# Altium schematic sheet Sheet1.SchDoc
size A3
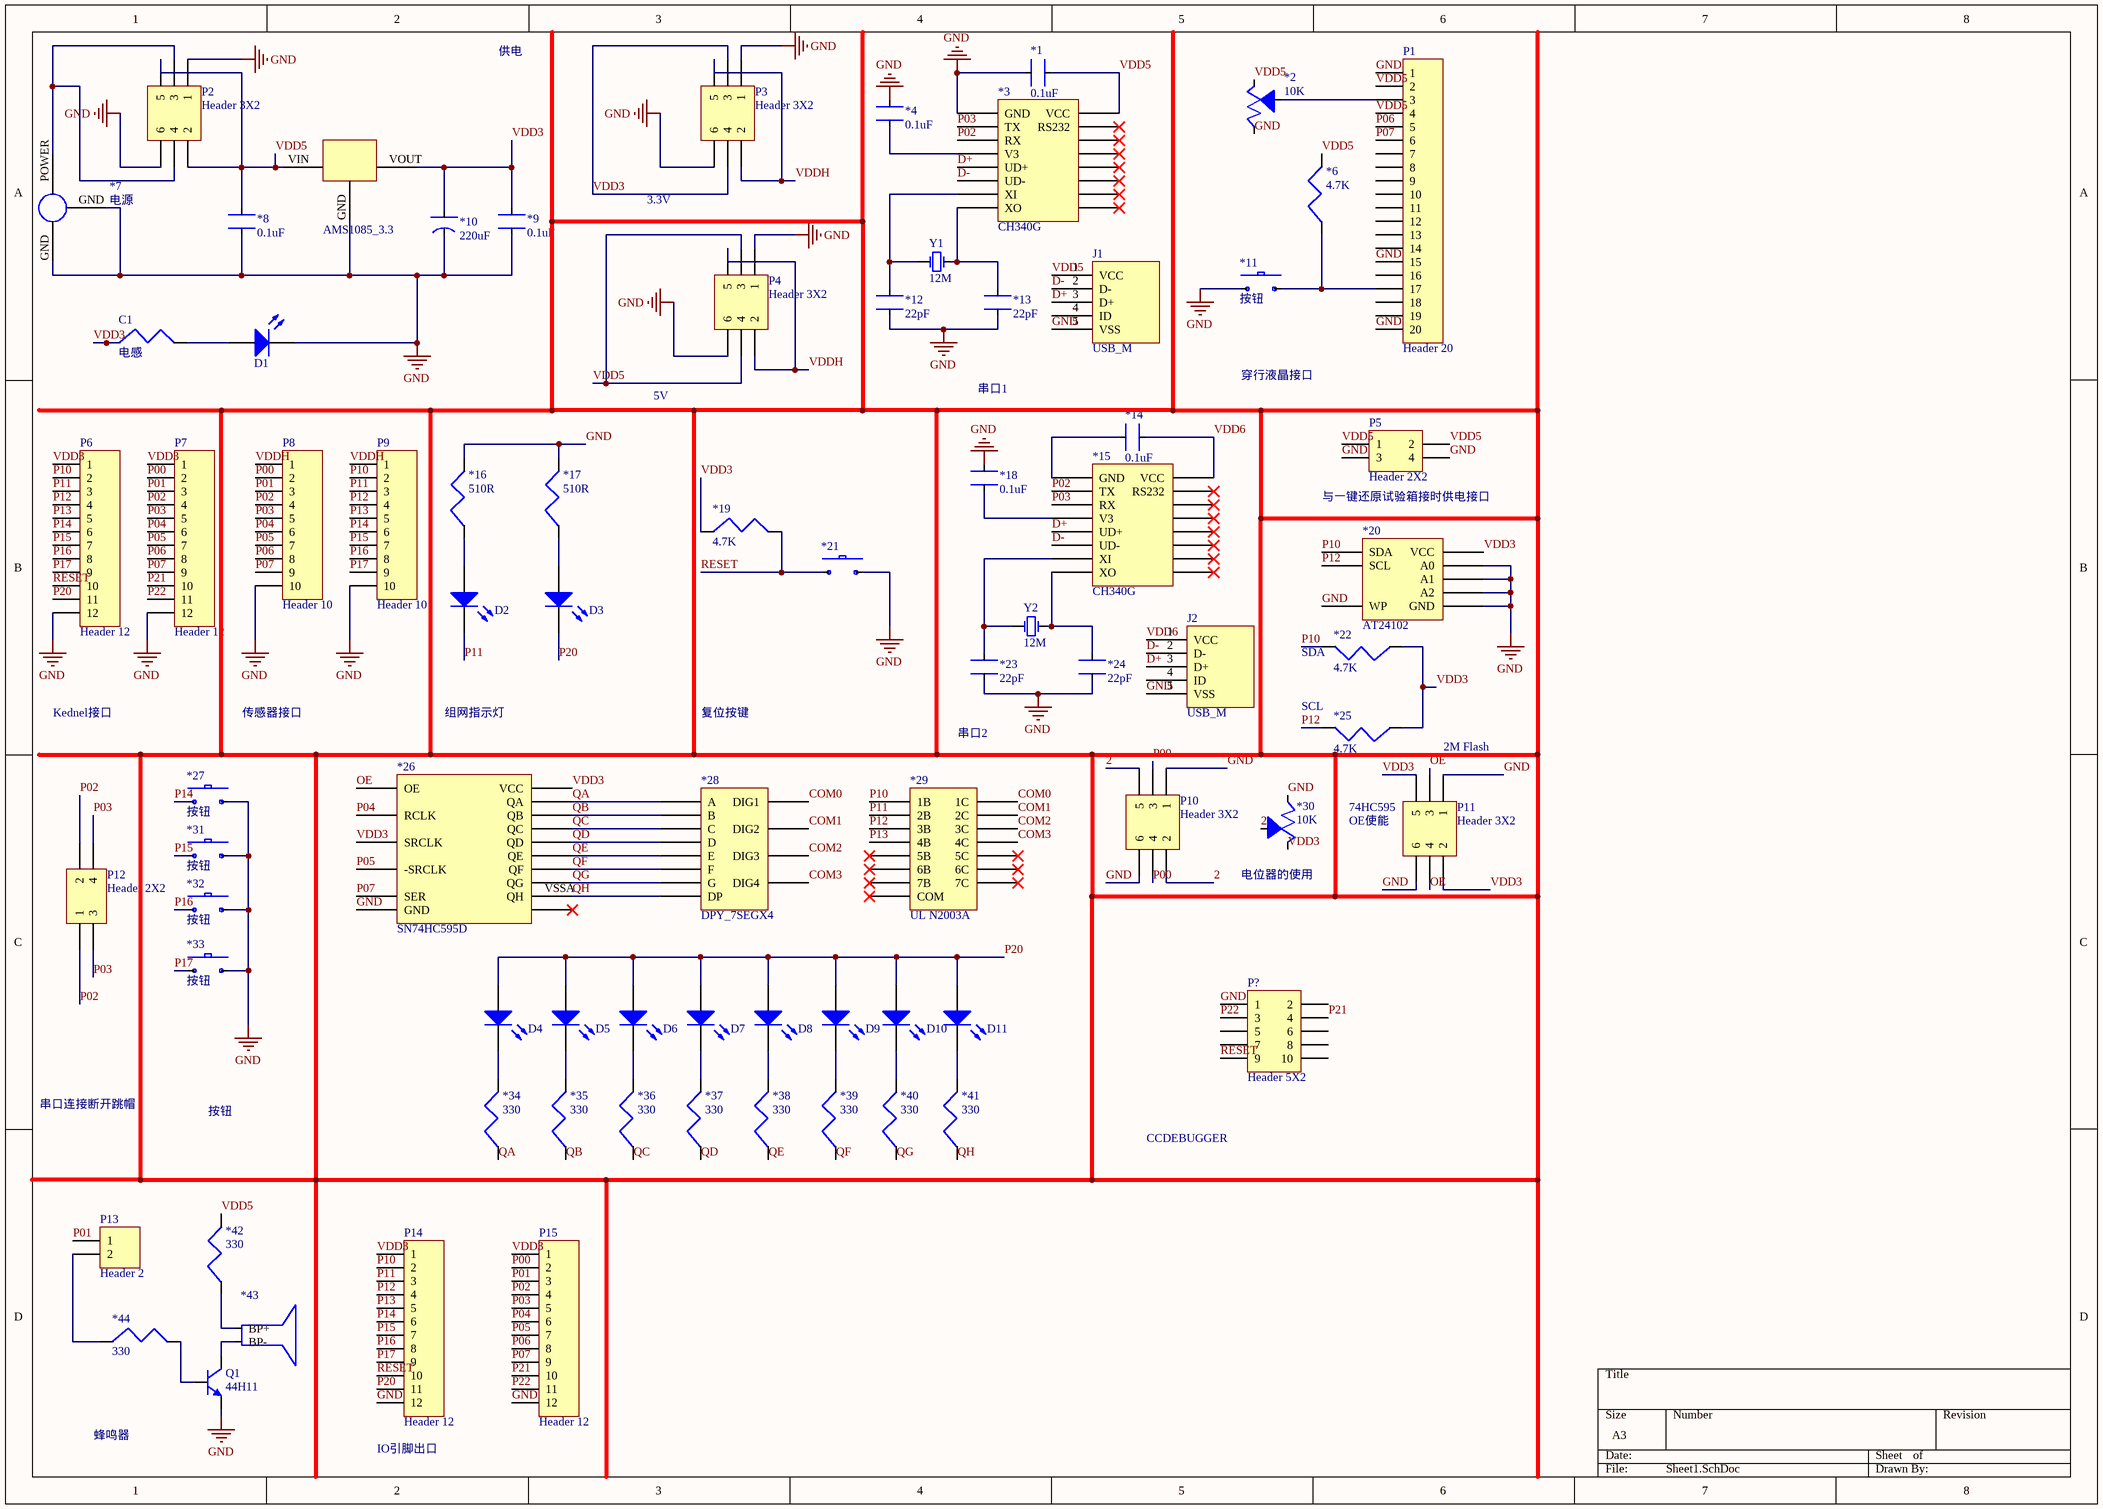
[diagram p0: Sheet1.SchDoc]

## Parts
*1  0.1uF  [C 0805_L]
*2  10K  [3303W]
*3  CH340G  [CH340G]
*4  0.1uF  [C 0805_L]
*5  AMS1085_3.3  [AMS1117-3.3V-SOT-223]
*6  4.7K  [L 0805]
*7  电源  [DC-005 - duplicate]
*8  0.1uF  [C 0805_L]
*9  0.1uF  [C 0805_L]
*10  220uF  [CAP 2.5*6.3*11.2 - BK]
*11  按钮  [按钮-6*6*4.3]
*12  22pF  [C 0805_L]
*13  22pF  [C 0805_L]
*14  0.1uF  [C 0805_L]
*15  CH340G  [CH340G]
*16  510R  [L 0805]
*17  510R  [L 0805]
*18  0.1uF  [C 0805_L]
*19  4.7K  [L 0805]
*20  AT24102  [AT24C02]
*21  按钮  [按钮-6*6*4.3]  (value not drawn)
*22  4.7K  [L 0805]
*23  22pF  [C 0805_L]
*24  22pF  [C 0805_L]
*25  4.7K  [L 0805]
*26  SN74HC595D  [74HC595D]
*27  按钮  [按钮-6*6*4.3]
*28  DPY_7SEGX4  [数码管_4P]
*29  UL N2003A  [ULN2003A]
*30  10K  [CLK_VOLUME]
*31  按钮  [按钮-6*6*4.3]
*32  按钮  [按钮-6*6*4.3]
*33  按钮  [按钮-6*6*4.3]
*34  330  [L 0805]
*35  330  [L 0805]
*36  330  [L 0805]
*37  330  [L 0805]
*38  330  [L 0805]
*39  330  [L 0805]
*40  330  [L 0805]
*41  330  [L 0805]
*42  330  [L 0805]
*43  蜂鸣器  [蜂鸣器侧装]
*44  330  [L 0805]
C1  电感  [L 0805]
D1  LED0  [LED_0805_Blue]  (value not drawn)
D2  LED0  [LED_0805_Blue]  (value not drawn)
D3  LED0  [LED_0805_Blue]  (value not drawn)
D4  LED0  [LED_0805_Blue]  (value not drawn)
D5  LED0  [LED_0805_Blue]  (value not drawn)
D6  LED0  [LED_0805_Blue]  (value not drawn)
D7  LED0  [LED_0805_Blue]  (value not drawn)
D8  LED0  [LED_0805_Blue]  (value not drawn)
D9  LED0  [LED_0805_Blue]  (value not drawn)
D10  LED0  [LED_0805_Blue]  (value not drawn)
D11  LED0  [LED_0805_Blue]  (value not drawn)
J1  USB_M  [USB]
J2  USB_M  [USB]
P1  Header 20  [HDR1X20]
P2  Header 3X2  [HDR2X3]
P3  Header 3X2  [HDR2X3]
P4  Header 3X2  [HDR2X3]
P5  Header 2X2  [HDR2X2]
P6  Header 12  [HDR1X12]
P7  Header 12  [HDR1X12]
P8  Header 10  [HDR1X10]
P9  Header 10  [HDR1X10]
P10  Header 3X2  [HDR2X3]
P11  Header 3X2  [HDR2X3]
P12  Header 2X2  [HDR2X2]
P13  Header 2  [HDR1X2]
P14  Header 12  [HDR1X12]
P15  Header 12  [HDR1X12]
P?  Header 5X2  [HDR2X5]
Q1  44H11  [三极管_To-92]
Y1  12M  [5032]
Y2  12M  [5032]

## Nets
GND: *1.VSSA *2.VSSA *3.VSSA(GND) *4.VSSA *5.GND(VSSA) *7.GND(VSSA) *8.VSSA *9.VSSA *10.VSSA *11.VSSA *12.VSSA *13.VSSA *16.VSSA *17.VSSA *18.VSSA *20.VSSA(WP) *21.VSSA *23.VSSA *24.VSSA *26.VSSA(GND) *27.VSSA *30.VSSA *31.VSSA *32.VSSA *33.VSSA D1.2(K) J1.5(VSS) J2.5(VSS) P1.1 P1.15 P1.20 P2.1 P2.6 P3.1 P3.6 P4.1 P4.6 P5.3 P5.4 P6.12 P7.12 P8.10 P9.10 P10.1 P10.6 P11.1 P11.6 P14.12 P15.12 P?.1 Q1.3(E)
2: *30.VSSA P10.2 P10.5
COM0: *28.VSSA(DIG1) *29.VSSA(1C)
COM1: *28.VSSA(DIG2) *29.VSSA(2C)
COM2: *28.VSSA(DIG3) *29.VSSA(3C)
COM3: *28.VSSA(DIG4) *29.VSSA(4C)
D+: *3.VSSA(UD+) *15.VSSA(UD+) J1.3(D+) J2.3(D+)
D-: *3.VSSA(UD-) *15.VSSA(UD-) J1.2(D-) J2.2(D-)
OE: *26.VSSA(OE) P11.3 P11.4
P00: P7.2 P8.2 P10.3 P10.4 P15.2
P01: P7.3 P8.3 P13.1 P15.3
P02: *3.VSSA(RX) *15.VSSA(TX) P7.4 P8.4 P12.1 P12.2 P15.4
P03: *3.VSSA(TX) *15.VSSA(RX) P7.5 P8.5 P12.3 P12.4 P15.5
P04: *26.VSSA(RCLK) P7.6 P8.6 P15.6
P05: *26.VSSA(-SRCLK) P7.7 P8.7 P15.7
P06: P1.5 P7.8 P8.8 P15.8
P07: *26.VSSA(SER) P1.6 P7.9 P8.9 P15.9
P10: *20.VSSA(SDA) *22.VSSA *29.VSSA(1B) P6.2 P9.2 P14.2
P11: *29.VSSA(2B) D2.2(K) P6.3 P9.3 P14.3
P12: *20.VSSA(SCL) *25.VSSA *29.VSSA(3B) P6.4 P9.4 P14.4
P13: *29.VSSA(4B) P6.5 P9.5 P14.5
P14: *27.VSSA P6.6 P9.6 P14.6
P15: *31.VSSA P6.7 P9.7 P14.7
P16: *32.VSSA P6.8 P9.8 P14.8
P17: *33.VSSA P6.9 P9.9 P14.9
P20: D3.2(K) D4.1(A) D5.1(A) D6.1(A) D7.1(A) D8.1(A) D9.1(A) D10.1(A) D11.1(A) P6.11 P14.11
P21: P7.10 P15.10 P?.4
P22: P7.11 P15.11 P?.3
QA: *26.VSSA(QA) *28.VSSA(A) *34.VSSA
QB: *26.VSSA(QB) *28.VSSA(B) *35.VSSA
QC: *26.VSSA(QC) *28.VSSA(C) *36.VSSA
QD: *26.VSSA(QD) *28.VSSA(D) *37.VSSA
QE: *26.VSSA(QE) *28.VSSA(E) *38.VSSA
QF: *26.VSSA(QF) *28.VSSA(F) *39.VSSA
QG: *26.VSSA(QG) *28.VSSA(G) *40.VSSA
QH: *26.VSSA(QH) *28.VSSA(DP) *41.VSSA
RESET: *19.VSSA *21.VSSA P6.10 P14.10 P?.9
VDD3: *5.VOUT(VSSA) *9.VSSA *10.VSSA *19.VSSA *20.VSSA(VCC) *22.VSSA *25.VSSA *26.VSSA(VCC) *30.VSSA C1.VSSA P3.3 P3.4 P6.1 P7.1 P11.2 P11.5 P14.1 P15.1
VDD5: *1.VSSA *2.VSSA *3.VSSA(VCC) *5.VIN(VSSA) *6.VSSA *8.VSSA *42.VSSA J1.1(VCC) P1.2 P1.4 P2.2 P2.5 P4.3 P4.4 P5.1 P5.2
VDD6: *14.VSSA *15.VSSA(VCC) J2.1(VCC)
VDDH: P3.2 P3.5 P4.2 P4.5 P8.1 P9.1
Net*2_VSSA: *2.VSSA P1.3
Net*3_VSSA: *3.VSSA(V3) *4.VSSA
Net*3_VSSA: *3.VSSA(XI) *12.VSSA Y1.1(OSC1)  [a separate net that carries the same name]
Net*3_VSSA: *3.VSSA(XO) *13.VSSA Y1.2(OSC2)  [a separate net that carries the same name]
Net*6_VSSA: *6.VSSA *11.VSSA P1.17
Net*7_POWER: *7.POWER(VSSA) P2.3 P2.4
Net*14_VSSA: *14.VSSA *15.VSSA(GND)
Net*15_VSSA: *15.VSSA(V3) *18.VSSA
Net*15_VSSA: *15.VSSA(XI) *23.VSSA Y2.1(OSC1)  [a separate net that carries the same name]
Net*15_VSSA: *15.VSSA(XO) *24.VSSA Y2.2(OSC2)  [a separate net that carries the same name]
Net*16_VSSA: *16.VSSA D2.1(A)
Net*17_VSSA: *17.VSSA D3.1(A)
Net*34_VSSA: *34.VSSA D4.2(K)
Net*35_VSSA: *35.VSSA D5.2(K)
Net*36_VSSA: *36.VSSA D6.2(K)
Net*37_VSSA: *37.VSSA D7.2(K)
Net*38_VSSA: *38.VSSA D8.2(K)
Net*39_VSSA: *39.VSSA D9.2(K)
Net*40_VSSA: *40.VSSA D10.2(K)
Net*41_VSSA: *41.VSSA D11.2(K)
Net*42_VSSA: *42.VSSA *43.VSSA(BP+)
Net*43_VSSA: *43.VSSA(BP-) Q1.2(C)
Net*44_VSSA: *44.VSSA P13.2
Net*44_VSSA: *44.VSSA Q1.1(B)  [a separate net that carries the same name]
NetC1_VSSA: C1.VSSA D1.1(A)

Not connected (* = marked no-connect by the designer): J1 4(ID); J2 4(ID); P1 7 8 9 10 11 12 13 14 16 18 19; P? 2 5 6 7 8 10

## Notes on the sheet
- 供电
- 3.3V
- 穿行液晶接口
- 5V
- 串口1
- 与一键还原试验箱接时供电接口
- Kednel接口
- 传感器接口
- 组网指示灯
- 复位按键
- (near *22) SDA
- (near *25) SCL
- 串口2
- 2M Flash
- OE使能
- (near P11) 74HC595
- (near *30) 电位器的使用
- 串口连接断开跳帽
- 按钮
- CCDEBUGGER
- (near P14) IO引脚出口

## Library data of the parts
*1 *4 *8 *9 *12-*14 *18 *23 *24 = 电容0805C
*2 *30 = 电位器_1
*6 *16 *17 *19 *22 *25 *34-*42 *44 = 电感
*10 = 钽电容
D1-D11 = LED0: 发光二极管; Published: 8-Jun-2000; LatestRevisionDate: 08-Jul-2005; LatestRevisionNote: Mech Layer 1 removed.; PackageReference: LED-0; Publisher: Altium Limited
J1 J2 = USB_M: MicroUSB接口
P1 = Header 20: Header, 20-Pin; LatestRevisionDate: 17-Jul-2002; LatestRevisionNote: Re-released for DXP Platform.; Publisher: Altium Limited
P2-P4 P10 P11 = Header 3X2: Header, 3-Pin, Dual row; LatestRevisionDate: 17-Jul-2002; LatestRevisionNote: Re-released for DXP Platform.; Publisher: Altium Limited
P5 P12 = Header 2X2: Header, 2-Pin, Dual row; LatestRevisionDate: 17-Jul-2002; LatestRevisionNote: Re-released for DXP Platform.; Publisher: Altium Limited
P6 P7 P14 P15 = Header 12: Header, 12-Pin; LatestRevisionDate: 17-Jul-2002; LatestRevisionNote: Re-released for DXP Platform.; Publisher: Altium Limited
P8 P9 = Header 10: Header, 10-Pin; LatestRevisionDate: 17-Jul-2002; LatestRevisionNote: Re-released for DXP Platform.; Publisher: Altium Limited
P13 = Header 2: Header, 2-Pin; LatestRevisionDate: 17-Jul-2002; LatestRevisionNote: Re-released for DXP Platform.; Publisher: Altium Limited
P? = Header 5X2: Header, 5-Pin, Dual row; LatestRevisionDate: 17-Jul-2002; LatestRevisionNote: Re-released for DXP Platform.; Publisher: Altium Limited
Q1 = 44H11: 互补功率-NPN型; 版权归属: 源创客; 属性: 80V 8A 50W; BOM名称: 互补功率-NPN型; 学习资源: www.ooocke.com
Y1 Y2 = XTAL: 晶振; Published: 8-Jun-2000; LatestRevisionDate: 17-Jul-2002; LatestRevisionNote: Re-released for DXP Platform.; PackageReference: R38; Publisher: Altium Limited